# EAGLE design labproject (EAGLE 9.6.2)
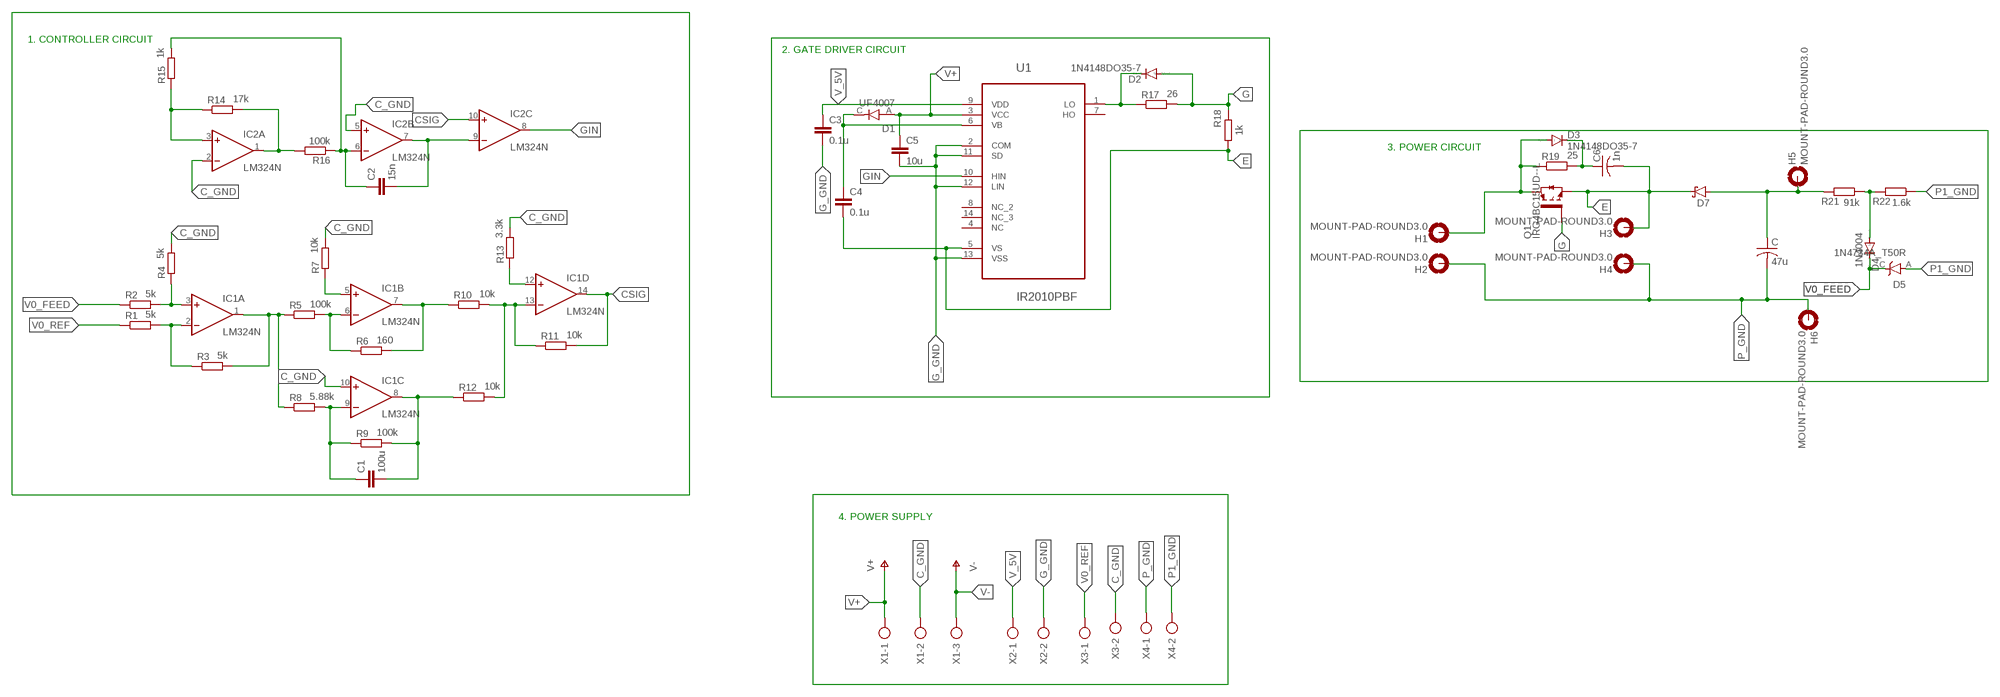
[diagram p0: schematic, sheet 1]

## Parts
C  47u  C-US075-032X103  [C075-032X103]
C1  100u  C-EU025-024X044  [C025-024X044]
C2  15n  C-EU025-024X044  [C025-024X044]
C3  0.1u  C-EU025-024X044  [C025-024X044]
C4  0.1u  C-EU025-024X044  [C025-024X044]
C5  10u  C-EU025-024X044  [C025-024X044]
C6  1n  C-US075-032X103  [C075-032X103]
D1  UF4007  [DIOAD1055W87L533D272]
D2  1N4148DO35-7  [DO35-7]
D3  1N4148DO35-7  [DO35-7]
D4  1N4004  [DO41-10]
D5  1N4734A_T50R  [DIOAD1070W78L463D238P]
D7  SCHOTTKY-DIODEDO201T15  [DO201T15]
H1  MOUNT-PAD-ROUND3.0  [3,0-PAD]
H2  MOUNT-PAD-ROUND3.0  [3,0-PAD]
H3  MOUNT-PAD-ROUND3.0  [3,0-PAD]
H4  MOUNT-PAD-ROUND3.0  [3,0-PAD]
H5  MOUNT-PAD-ROUND3.0  [3,0-PAD]
H6  MOUNT-PAD-ROUND3.0  [3,0-PAD]
IC1  LM324N  [DIL14]
IC2  LM324N  [DIL14]
Q1  IRG4BC15UD--L  [TO262-V]
R1  5k  R-EU_0204/7  [0204/7]
R2  5k  R-EU_0204/7  [0204/7]
R3  5k  R-EU_0204/7  [0204/7]
R4  5k  R-EU_0204/7  [0204/7]
R5  100k  R-EU_0204/7  [0204/7]
R6  160  R-EU_0204/7  [0204/7]
R7  10k  R-EU_0204/7  [0204/7]
R8  5.88k  R-EU_0204/7  [0204/7]
R9  100k  R-EU_0204/7  [0204/7]
R10  10k  R-EU_0204/7  [0204/7]
R11  10k  R-EU_0204/7  [0204/7]
R12  10k  R-EU_0204/7  [0204/7]
R13  3.3k  R-EU_0204/7  [0204/7]
R14  17k  R-EU_0204/7  [0204/7]
R15  1k  R-EU_0204/7  [0204/7]
R16  100k  R-EU_0204/7  [0204/7]
R17  26  R-EU_0204/7  [0204/7]
R18  1k  R-EU_0204/7  [0204/7]
R19  25  R-EU_0204/7  [0204/7]
R21  91k  R-EU_0204/7  [0204/7]
R22  1.6k  R-EU_0204/7  [0204/7]
U1  IR2010PBF  [DIP254P762X533-14]
X1  AK300/3  [AK300/3]
X2  AK300/2  [AK300/2]
X3  AK300/2  [AK300/2]
X4  AK300/2  [AK300/2]

## Nets
C_GND: IC1.10(C:+IN) IC2.2(A:-IN) IC2.5(B:+IN) R4.2 R7.2 R13.2 X1.2 X3.2
CSIG: IC1.14(D:OUT) IC2.10(C:+IN) R11.2
E: C4.2 C6.2 D7.C H3.B3,0(MOUNT) Q1.3(E) R18.2 U1.5(VS)
G: D2.A Q1.1(G) R17.2 R18.1
G_GND: C3.2 C5.2 U1.2(COM) U1.11(SD) U1.12(LIN) U1.13(VSS) X2.2
GIN: IC2.8(C:OUT) U1.10(HIN)
N$1: IC1.3(A:+IN) R2.2 R4.1
N$2: IC1.2(A:-IN) R1.2 R3.1
N$3: IC1.1(A:OUT) R3.2 R5.1 R8.1
N$6: IC1.6(B:-IN) R5.2 R6.1
N$7: IC1.5(B:+IN) R7.1
N$8: IC1.7(B:OUT) R6.2 R10.1
N$9: IC1.13(D:-IN) R10.2 R11.1 R12.2
N$10: C1.1 IC1.9(C:-IN) R8.2 R9.1
N$12: C1.2 IC1.8(C:OUT) R9.2 R12.1
N$13: IC1.12(D:+IN) R13.1
N$14: IC2.1(A:OUT) R14.2 R16.2
N$15: IC2.3(A:+IN) R14.1 R15.1
N$16: C2.1 IC2.6(B:-IN) R15.2 R16.1
N$17: C2.2 IC2.7(B:OUT) IC2.9(C:-IN)
N$21: C4.1 D1.C(K) U1.6(VB)
N$25: D2.C R17.1 U1.1(LO)
N$27: D3.A H1.B3,0(MOUNT) Q1.2(C) R19.1
N$28: C6.1 D3.C R19.2
N$31: C.1 D7.A H5.B3,0(MOUNT) R21.2
N$33: D4.A R21.1 R22.2
P1_GND: D5.A R22.1 X4.2
P_GND: C.2 H2.B3,0(MOUNT) H4.B3,0(MOUNT) H6.B3,0(MOUNT) X4.1
V0_FEED: D4.C D5.C R2.1
V0_REF: R1.1 X3.1
V+: C5.1 D1.A U1.3(VCC) X1.1
V-: X1.3
V_5V: C3.1 U1.9(VDD) X2.1
Unconnected: IC2.12(D:+IN) IC2.13(D:-IN) IC2.14(D:OUT) U1.4(NC) U1.7(HO) U1.8(NC_2) U1.14(NC_3)

## Notes on the sheet
- 1. CONTROLLER CIRCUIT
- 2. GATE DRIVER CIRCUIT
- 3. POWER CIRCUIT
- 4. POWER SUPPLY

## Power pins joined to a net without a drawn wire
V+: IC1.4(P:V+) IC2.4(P:V+)
V-: IC1.11(P:V-) IC2.11(P:V-)

## Library data of the parts
C C6 = rcl:C-US: CAPACITOR, American symbol; SPICEPREFIX: C
C1-C5 = rcl:C-EU: CAPACITOR, European symbol; SPICEPREFIX: C
D1 = UF4007:UF4007: Diode Standard 1000V 1A Through Hole DO-204AL (DO-41) Check prices <https://pricing.snapeda.com/parts/UF4007/ON%20Semiconductor/view-part?ref=eda>; AVAILABILITY: In Stock; DESCRIPTION: Diode Standard 1000V 1A Through Hole DO-204AL (DO-41); MF: ON Semiconductor; MP: UF4007; PACKAGE: DO-41-2 ON Semiconductor; PRICE: None; PURCHASE-URL: https://pricing.snapeda.com/search/part/UF4007/?ref=eda
D2 D3 = diode:1N4148: DIODE high speed (Philips)
D4 = diode:1N4004: DIODE general purpose rectifier, 1 A
D5 = 1N4734A_T50R:1N4734A_T50R: 1N4734 Series 1 W 5.6 V 10 uA Through Hole Zener Diode - DO-41 Check prices <https://pricing.snapeda.com/parts/1N4734A_T50R/ON%20Semiconductor/view-part?ref=eda>; AVAILABILITY: Not in stock; DESCRIPTION: Zener Diode 5.6 V 1 W ±5% Through Hole DO-41; MF: ON Semiconductor; MP: 1N4734A_T50R; PACKAGE: DO-41 ON Semiconductor; PRICE: None
D7 = diode:SCHOTTKY-DIODE: Schottky Diode
H1-H6 = holes:MOUNT-PAD-ROUND: MOUNTING PAD, round
IC1 IC2 = linear:LM324: OP AMP
Q1 = IRG4BC15UD-:IRG4BC15UD-: INSULATED GATE BIPOLAR TRANSISTOR WITH ULTRAFAST SOFT RECOVERY DIODE Check prices <https://pricing.snapeda.com/parts/IRG4BC15UD/Infineon/view-part?ref=eda>; AVAILABILITY: In Stock; DESCRIPTION: IGBT 600V 14A 49W Through Hole TO-220AB; MF: Infineon; MP: IRG4BC15UD; PACKAGE: TO-220 Vishay; PRICE: None; PURCHASE-URL: https://pricing.snapeda.com/search/part/IRG4BC15UD/?ref=eda
R1-R19 R21 R22 = rcl:R-EU_: RESISTOR, European symbol; SPICEPREFIX: R
U1 = IR2010PBF:IR2010PBF: HIGH AND LOW SIDE DRIVER Check prices <https://pricing.snapeda.com/parts/IR2010PBF/Infineon%20Technologies/view-part?ref=eda>; AVAILABILITY: In Stock; DESCRIPTION: IR2010 Series 200 V 3 A 20 V Supply Dual High And Low Side Driver - PDIP-14; MF: Infineon Technologies; MP: IR2010PBF; PACKAGE: DIP-14 International Rectifier; PRICE: None; PURCHASE-URL: https://pricing.snapeda.com/search/part/IR2010PBF/?ref=eda
X1 = con-ptr500:AK300/3: CONNECTOR; OC_FARNELL: unknown; OC_NEWARK: unknown
X2-X4 = con-ptr500:AK300/2: CONNECTOR; OC_FARNELL: unknown; OC_NEWARK: unknown

## Board
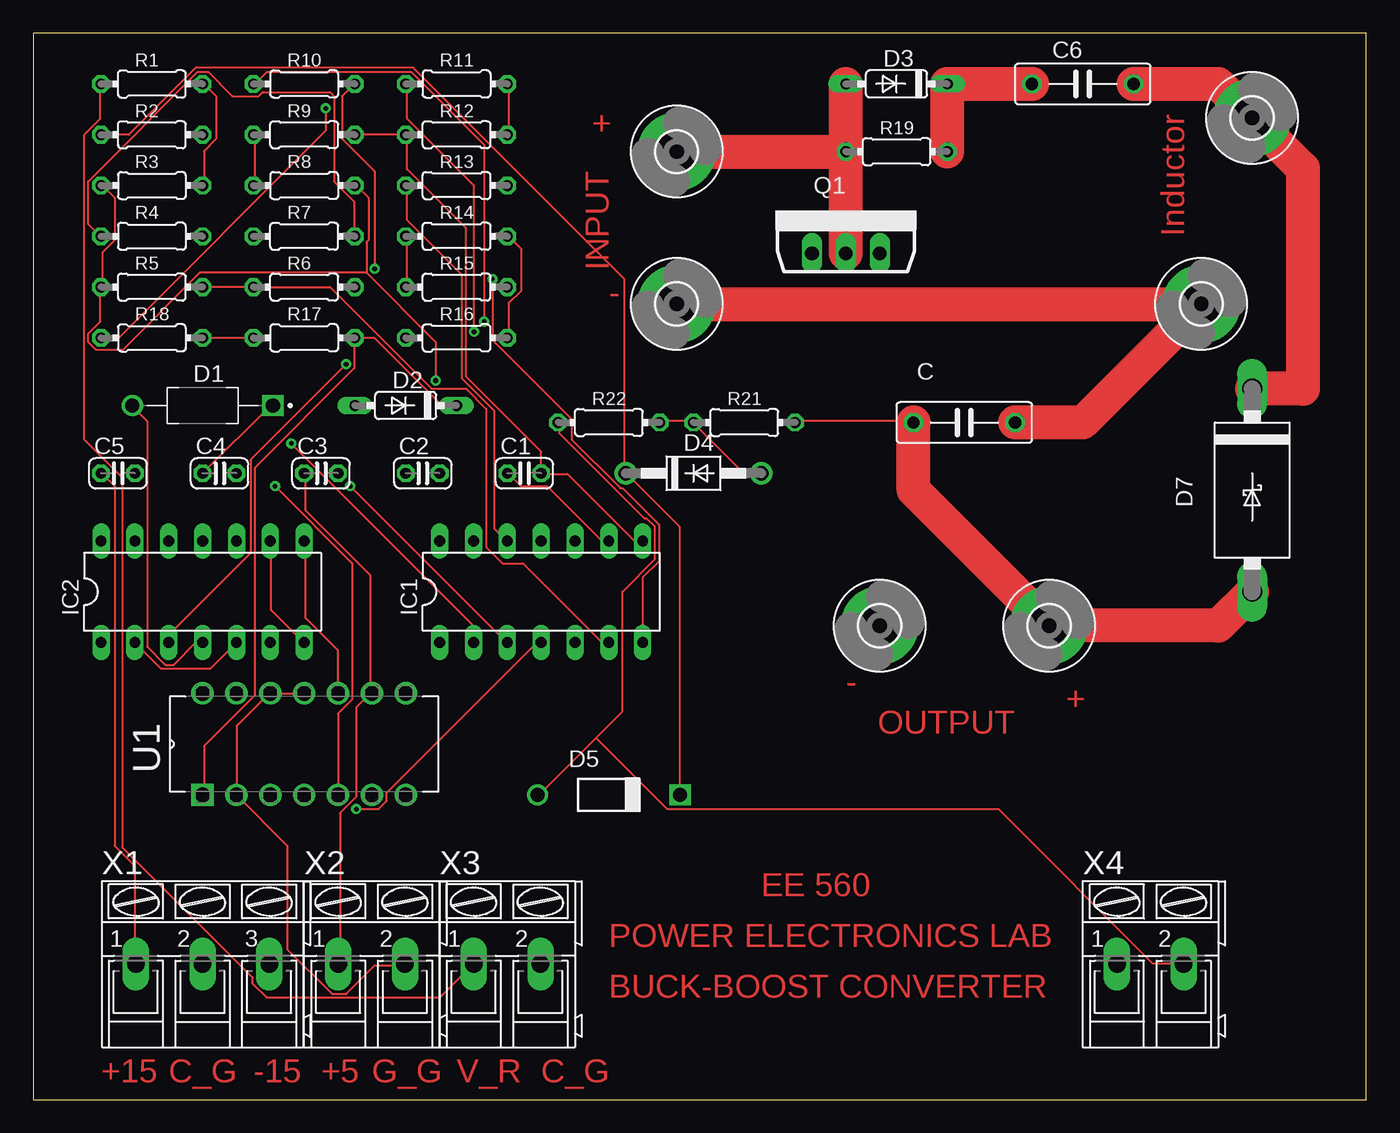
[diagram p1: board, top side]
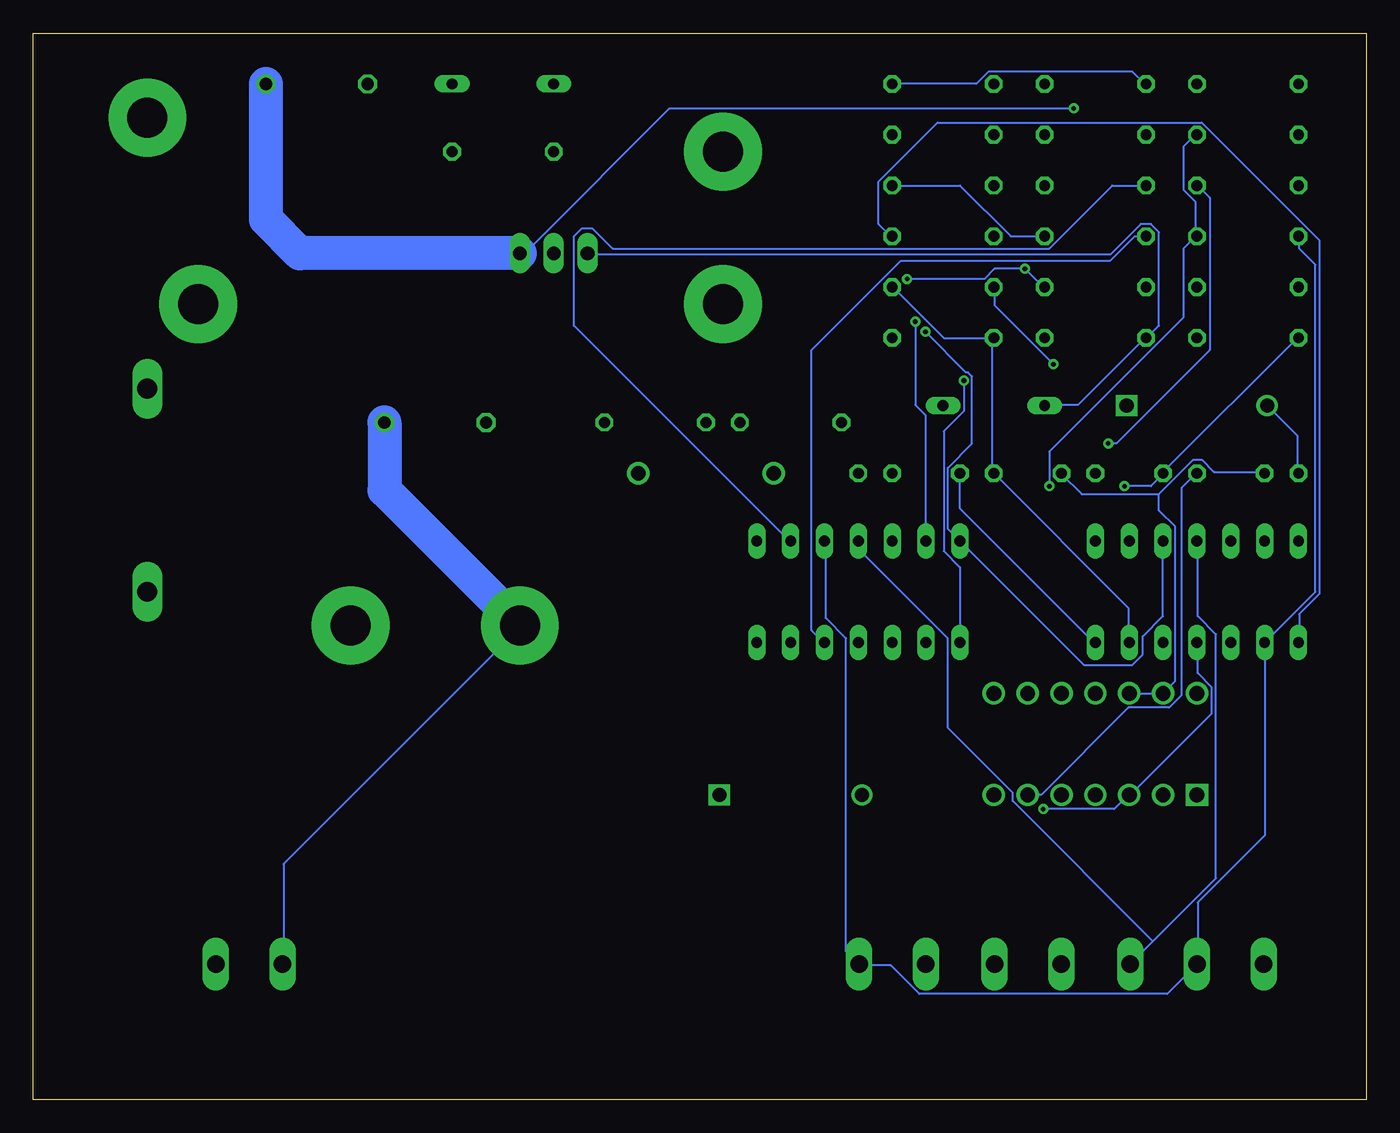
[diagram p2: board, bottom side, seen from below]

Size 100 x 80 mm. Coordinates in mm from the lower left corner, seen from the top.
Outline: 0,0 100,0 100,80 0,80 0,0
Copper layers (1*16): Top 0.035mm / dielectric 1.5mm / Bottom 0.035mm
Design rules "default": minimum track width 6mil, minimum drill 0.35mm, track to track 6mil, track to pad 6mil, pad to pad 6mil, via to via 6mil, smd to smd 6mil, copper to edge 40mil, drill to drill 6mil, minimum pad ring 10mil, minimum via ring 8mil, stop-mask expansion 4mil, vias tented up to drill 0mil, thermal gap 10mil

### Footprints (pad centres in the part's own frame; a part is rotated, then mirrored left to right if it is on the bottom)
C075-032X103 = drill 0.914 octagon: 1 -3.81,0; 2 3.81,0
C025-024X044 = drill 0.813 octagon: 1 -1.27,0; 2 1.27,0
DIOAD1055W87L533D272 = drill 1.07 pad 1.61: A 5.275,0 | drill 1.07 pad 1.61 square: C -5.275,0
DO35-7 = drill 0.813 long: A 3.81,0; C -3.81,0
DO41-10 = drill 1.118: A 5.08,0; C -5.08,0
DIOAD1070W78L463D238P = drill 1.06 pad 1.6: A 5.35,0 | drill 1.06 pad 1.6 square: C -5.35,0
DO201T15 = drill 1.499 long: A 7.62,0; C -7.62,0
3,0-PAD = drill 3 pad 5.842: B3,0 0,0
DIL14 = drill 0.813 long: 1 -7.62,-3.81; 2 -5.08,-3.81; 3 -2.54,-3.81; 4 0,-3.81; 5 2.54,-3.81; 6 5.08,-3.81; 7 7.62,-3.81; 8 7.62,3.81; 9 5.08,3.81; 10 2.54,3.81; 11 0,3.81; 12 -2.54,3.81; 13 -5.08,3.81; 14 -7.62,3.81
TO262-V = drill 1.016 long: 1 -2.54,0; 2 0,0; 3 2.54,0
0204/7 = drill 0.813 octagon: 1 -3.81,0; 2 3.81,0
DIP254P762X533-14 = drill 1.118 square: 1 -7.62,15.24 | drill 1.118: 2 -7.62,12.7; 3 -7.62,10.16; 4 -7.62,7.62; 5 -7.62,5.08; 6 -7.62,2.54; 7 -7.62,0; 8 0,0; 9 0,2.54; 10 0,5.08; 11 0,7.62; 12 0,10.16; 13 0,12.7; 14 0,15.24
AK300/3 = drill 1.321 long: 1 -5.004,0; 2 0,0; 3 5.004,0
AK300/2 = drill 1.321 long: 1 -2.515,0; 2 2.489,0

### Placement (x,y rotation side)
C  69.85,50.8 0 top
C1  36.83,46.99 0 top
C2  29.21,46.99 0 top
C3  21.59,46.99 0 top
C4  13.97,46.99 0 top
C5  6.35,46.99 0 top
C6  78.74,76.2 0 top
D1  12.7,52.07 180 top
D2  27.94,52.07 180 top
D3  64.77,76.2 180 top
D4  49.53,46.99 0 top
D5  43.18,22.86 180 top
D7  91.44,45.72 270 top
H1  48.26,71.12 0 top
H2  87.63,59.69 0 top
H3  91.44,73.66 0 top
H4  48.26,59.69 0 top
H5  76.2,35.56 0 top
H6  63.5,35.56 0 top
IC1  38.1,38.1 0 top
IC2  12.7,38.1 0 top
Q1  60.96,63.5 0 top
R1  8.89,76.2 0 top
R2  8.89,72.39 0 top
R3  8.89,68.58 180 top
R4  8.89,64.77 180 top
R5  8.89,60.96 0 top
R6  20.32,60.96 0 top
R7  20.32,64.77 0 top
R8  20.32,68.58 180 top
R9  20.32,72.39 0 top
R10  20.32,76.2 180 top
R11  31.75,76.2 180 top
R12  31.75,72.39 0 top
R13  31.75,68.58 0 top
R14  31.75,64.77 0 top
R15  31.75,60.96 0 top
R16  31.75,57.15 0 top
R17  20.32,57.15 180 top
R18  8.89,57.15 180 top
R19  64.77,71.12 0 top
R21  53.34,50.8 0 top
R22  43.18,50.8 0 top
U1  27.94,30.48 90 top
X1  12.7,10.16 0 top
X2  25.4,10.16 0 top
X3  35.56,10.16 0 top
X4  83.82,10.16 0 top

### Tracks (layer width: path | path; a pad name or v marks a point on that pad's centre or on a via)
C_GND
  Top 0.152: IC2.2 9.6,32.31 13.26,32.31 IC2.5 | R7.2 24.08,64.77 24.08,67.36 22.55,68.89 22.55,75.29 22.25,75.59 17.22,75.59 16.92,75.29 14.94,75.29 13.11,77.11 12.34,77.11 4.12,68.89 4.12,65.68 5.03,64.77 R4.2
  Bottom 0.152: IC1.10 40.54,41.91 40.54,36.12 39.01,34.59 39.01,11.12 X3.2 37.95,10.06 35.66,10.06 33.53,7.92 14.94,7.92 X1.2 12.65,10.21 12.65,14.78 7.62,19.81 IC2.2 3.81,38.1 3.81,62.64 5.03,63.86 5.03,64.77 R4.2 | R7.2 26.67,64.77 30.48,68.58 R13.2
CSIG  (via drill 0.35)
  Top 0.152: v33.07,57.61 33.07,68.58 28.04,73.61 28.04,76.2 R11.2
  Bottom 0.152: IC2.10 15.24,36.27 16.76,34.75 16.76,33.38 17.53,32.61 21.18,32.61 IC1.14 31.39,42.82 31.39,47.4 29.57,49.23 29.57,54.25 29.87,54.56 30.02,54.56 v33.07,57.61
E  (via drill 0.35)
  Top 0.152: U1.5 22.86,28.96 23.93,30.02 23.93,40.23 v18.14,46.02 | R18.2 6.4,57.15 21.95,72.69 v21.95,74.37
  Top 2.54: C6.2 88.9,76.2 H3.B3,0 95.25,69.85 95.25,53.34 D7.C
  Bottom 0.152: R18.2 5.18,57.15 15.24,47.09 C4.2 15.24,46.94 16.15,46.02 v18.14,46.02 | v21.95,74.37 52.27,74.37 62.48,64.16 Q1.3
  Bottom 2.54: Q1.3 80.01,63.5 82.55,66.04 C6.2
G
  Top 0.152: R17.2 R18.1
  Bottom 0.152: D2.A 24.08,52.12 21.64,52.12 16.61,57.15 R17.2 16.46,57.15 15.54,58.06 15.54,65.08 16.15,65.68 16.92,65.68 19.2,63.4 58.37,63.4 Q1.1
G_GND
  Top 0.152: U1.11 U1.12 17.68,30.48 15.24,28.04 U1.2 19.05,19.05 19.05,11.28 22.4,7.92 23.47,7.92 25.6,10.06 27.89,10.06 X2.2
  Bottom 0.152: 15.54,45.41 12.95,48.01 12.34,48.01 11.43,47.09 7.62,47.09 C5.2 | 15.54,45.41 21.34,45.41 22.86,46.94 C3.2 | U1.12 U1.13 14.33,31.39 14.33,42.98 15.54,44.2 15.54,45.41
GIN
  Top 0.152: U1.10 22.86,33.68 20.42,36.12 20.42,41.91 IC2.8
N$1  (via drill 0.35)
  Top 0.152: v23.77,46.02 35.51,34.29 IC1.3
  Bottom 0.152: 12.8,64.77 12.8,67.36 13.72,68.28 13.72,71.48 12.8,72.39 R2.2 | v23.77,46.02 23.77,48.62 13.72,58.67 13.72,63.86 12.8,64.77 | 12.8,64.77 R4.1
N$2  (via drill 0.35)
  Top 0.152: R3.1 12.8,68.58 12.8,71.17 13.72,72.08 13.72,75.29 12.8,76.2 R1.2 | v19.36,49.23 32.92,35.66 32.92,34.29 IC1.2
  Bottom 0.152: v19.36,49.23 18.75,49.23 11.73,56.24 11.73,67.67 12.65,68.58 R3.1
N$3  (via drill 0.35)
  Top 0.152: R3.2 5.18,68.58 6.1,67.67 6.1,64.47 5.18,63.55 5.18,60.96 R5.1 5.03,60.96 5.03,58.37 4.12,57.45 4.12,56.84 4.72,56.24 6.71,56.24 12.5,62.03 24.99,62.03 | v30.18,53.95 30.18,56.84 24.99,62.03 | 24.99,62.03 24.99,64.31 25.15,64.47 25.15,67.67 24.23,68.58 R8.1
  Bottom 0.152: IC1.1 30.48,39.93 31.7,41.15 31.7,50.14 30.18,51.66 v30.18,53.95
N$6
  Top 0.152: R5.2 R6.1 22.25,60.96 29.87,53.34 32.46,53.34 33.98,51.82 33.98,41.45 35.2,40.23 36.73,40.23 42.67,34.29 IC1.6
N$7
  Bottom 0.152: R7.1 17.37,64.77 19.2,62.94 34.9,62.94 41.6,56.24 41.6,35.2 40.69,34.29 IC1.5
N$8  (via drill 0.35)
  Top 0.152: v25.6,62.33 25.6,69.65 23.16,72.08 23.16,75.29 24.08,76.2 R10.1 | IC1.7 45.72,39.17 46.94,40.39 46.94,43.13 44.2,45.87 44.04,45.87 40.39,49.53 40.39,51.05 34.44,57 v34.44,61.57
  Bottom 0.152: R6.2 24.23,60.96 v25.6,62.33 27.89,62.33 28.65,61.57 v34.44,61.57
N$9  (via drill 0.35)
  Top 0.152: R12.2 35.66,72.39 35.66,76.2 R11.1 | v33.83,58.37 33.83,71.63 28.35,77.11 17.53,77.11 16.61,76.2 R10.2
  Bottom 0.152: v33.83,58.37 33.83,52.12 33.07,51.36 33.07,41.91 IC1.13 | R11.1 29.26,76.2 28.35,77.11 17.53,77.11 16.61,76.2 R10.2
N$10
  Top 0.152: R8.2 16.61,68.58 16.61,72.39 R9.1 | IC1.9 42.67,41.91 38.56,46.02 36.58,46.02 35.66,46.94 C1.1
  Bottom 0.152: R8.2 19.05,68.58 23.77,63.86 56.54,63.86 58.06,65.38 58.83,65.38 59.44,64.77 59.44,58.06 43.28,41.91 IC1.9
N$12
  Top 0.152: R9.2 R12.1 28.04,72.39 28.04,69.8 32.46,65.38 32.46,54.25 38.1,48.62 C1.2 38.1,46.94 40.08,46.94 45.11,41.91 IC1.8
N$13
  Top 0.152: R13.1 28.04,68.58 28.04,65.99 32.16,61.87 32.16,54.1 34.59,51.66 34.59,42.82 35.51,41.91 IC1.12
N$14
  Top 0.152: R16.2 35.66,57.15 35.66,59.74 36.58,60.66 36.58,63.86 35.66,64.77 R14.2
  Bottom 0.152: IC2.1 5.03,34.29 5.03,36.42 3.5,37.95 3.5,64.47 12.34,73.3 32.16,73.3 36.58,68.89 36.58,65.68 35.66,64.77 R14.2
N$15  (via drill 0.35)
  Top 0.152: v23.47,55.17 16.31,48.01 16.31,41 10.21,34.9 10.21,34.29 IC2.3 | R14.1 28.04,64.77 28.04,60.96 R15.1
  Bottom 0.152: v23.47,55.17 27.89,59.59 27.89,60.96 R15.1
N$16
  Bottom 0.152: 28.04,57.15 31.7,57.15 35.51,60.96 R15.2 | IC2.6 17.83,34.29 17.83,36.88 C2.1 28.04,47.09 28.04,57.15 | 28.04,57.15 R16.1
N$17
  Top 0.152: IC2.9 17.83,41.91 17.83,36.73 20.27,34.29 IC2.7
  Bottom 0.152: C2.2 30.48,44.35 20.42,34.29 IC2.7
N$21
  Top 0.152: C4.1 17.83,52.12 D1.C
  Bottom 0.152: U1.6 24.38,22.86 17.83,29.41 14.78,29.41 13.87,30.33 13.87,45.87 12.8,46.94 C4.1
N$25
  Top 0.152: D2.C 31.7,52.12 30.63,52.12 25.6,57.15 R17.1 24.08,57.15 24.08,54.86 16.61,47.4 16.61,30.33 12.8,26.52 12.8,22.86 U1.1
N$27
  Top 2.54: H1.B3,0 R19.1 | R19.1 D3.A | Q1.2 R19.1
N$28
  Top 2.54: C6.1 D3.C R19.2
N$31
  Top 0.152: R21.2 57.15,50.9 64.92,50.9 C.1
  Top 2.54: D7.A 88.9,35.56 H5.B3,0 66.04,45.72 C.1
N$33
  Top 0.152: R22.2 47.09,50.9 49.53,50.9 R21.1 49.53,50.75 53.19,47.09 54.56,47.09 D4.A
P1_GND
  Top 0.152: 42.22,27.13 37.95,22.86 D5.A | 42.22,27.13 44.2,29.11 44.2,38.1 46.63,40.54 46.63,42.98 46.02,43.59 45.87,43.59 39.47,49.99 39.47,50.75 R22.1 | 42.22,27.13 47.55,21.79 72.39,21.79 83.97,10.21 86.26,10.21 X4.2
P_GND
  Top 2.54: H4.B3,0 H2.B3,0 78.74,50.8 C.2
  Bottom 0.152: X4.1 81.23,10.21 81.23,17.68 64.31,34.59 H6.B3,0
  Bottom 2.54: H6.B3,0 73.66,45.72 C.2
V0_FEED
  Top 0.152: R2.1 7.16,72.39 12.19,77.42 28.5,77.42 44.35,61.57 44.35,47.09 D4.C 48.46,42.98 48.46,22.86 D5.C
V0_REF
  Top 0.152: R1.1 5.03,76.2 5.03,73.61 3.81,72.39 3.81,49.53 6.71,46.63 6.71,18.9 16.46,9.14 16.46,8.69 17.53,7.62 30.48,7.62 32.92,10.06 X3.1
V+  (via drill 0.35)
  Top 0.152: IC1.4 37.8,34.29 26.52,23.01 26.52,22.4 25.91,21.79 v24.23,21.79 | X1.1 7.62,10.21 7.62,17.53 6.1,19.05 6.1,46.02 5.18,46.94 C5.1 | IC2.4 12.19,34.29 10.52,32.61 9.91,32.61 8.53,33.98 8.53,50.9 7.47,51.97 D1.A
  Bottom 0.152: IC2.4 12.65,34.29 12.65,32 11.58,30.94 11.58,28.96 17.68,22.86 U1.3 17.83,22.86 18.9,21.79 v24.23,21.79 | C5.1 5.18,47.09 5.18,49.84 7.32,51.97 D1.A
V-
  Bottom 0.152: 16,11.89 17.68,10.21 X1.3 | 16,11.89 11.28,16.61 11.28,34.9 12.65,36.27 12.65,41.91 IC2.11 | IC1.11 38.1,41.3 31.39,34.59 31.39,27.89 26.52,23.01 26.52,22.4 16,11.89
V_5V
  Top 0.152: 25.3,30.48 25.3,39.32 20.42,44.2 20.42,46.94 C3.1 | 25.3,30.48 24.23,29.41 24.23,22.71 23.01,21.49 23.01,10.21 X2.1 | 25.3,30.48 U1.9

### Text on the board
Top: + | Inductor | INPUT | - | - | OUTPUT | + | EE 560 | POWER ELECTRONICS LAB | BUCK-BOOST CONVERTER | +15 | C_G | -15 | +5 | G_G | V_R | C_G